# EAGLE design TQFP32Adapter (EAGLE 6.4)
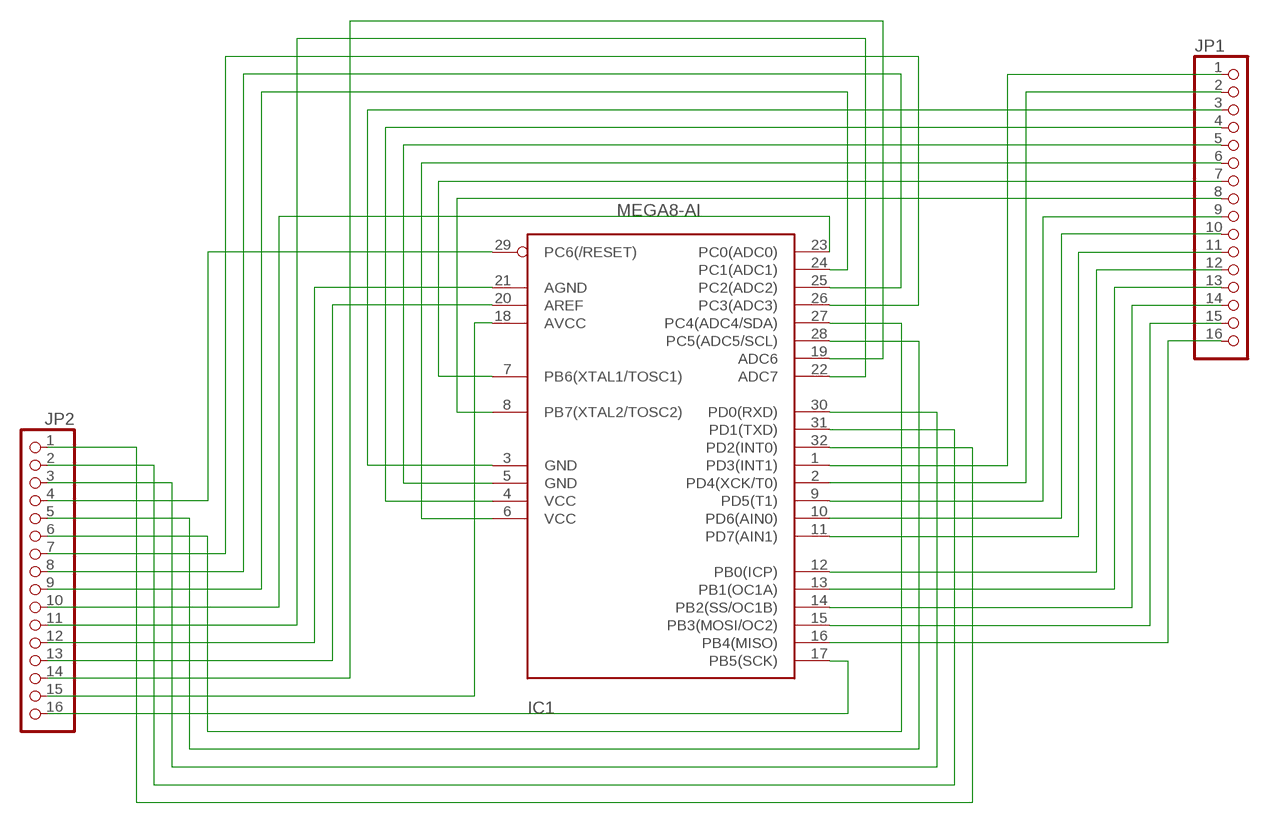
[diagram p0: schematic, sheet 1]

## Parts
IC1  MEGA8-AI  [TQFP32-08]
JP1  PINHD-1X16  [1X16]
JP2  PINHD-1X16  [1X16]

## Nets
N$1: IC1.1(PD3(INT1)) JP1.1
N$2: IC1.2(PD4(XCK/T0)) JP1.2
N$3: IC1.3(GND) JP1.3
N$4: IC1.4(VCC) JP1.4
N$5: IC1.5(GND) JP1.5
N$6: IC1.6(VCC) JP1.6
N$7: IC1.7(PB6(XTAL1/TOSC1)) JP1.7
N$8: IC1.8(PB7(XTAL2/TOSC2)) JP1.8
N$9: IC1.9(PD5(T1)) JP1.9
N$10: IC1.10(PD6(AIN0)) JP1.10
N$11: IC1.11(PD7(AIN1)) JP1.11
N$12: IC1.12(PB0(ICP)) JP1.12
N$13: IC1.13(PB1(OC1A)) JP1.13
N$14: IC1.14(PB2(SS/OC1B)) JP1.14
N$15: IC1.15(PB3(MOSI/OC2)) JP1.15
N$16: IC1.16(PB4(MISO)) JP1.16
N$17: IC1.17(PB5(SCK)) JP2.16
N$18: IC1.18(AVCC) JP2.15
N$19: IC1.19(ADC6) JP2.14
N$20: IC1.20(AREF) JP2.13
N$21: IC1.21(AGND) JP2.12
N$22: IC1.22(ADC7) JP2.11
N$23: IC1.23(PC0(ADC0)) JP2.10
N$24: IC1.24(PC1(ADC1)) JP2.9
N$25: IC1.25(PC2(ADC2)) JP2.8
N$26: IC1.26(PC3(ADC3)) JP2.7
N$27: IC1.27(PC4(ADC4/SDA)) JP2.6
N$28: IC1.28(PC5(ADC5/SCL)) JP2.5
N$29: IC1.29(PC6(/RESET)) JP2.4
N$30: IC1.30(PD0(RXD)) JP2.3
N$31: IC1.31(PD1(TXD)) JP2.2
N$32: IC1.32(PD2(INT0)) JP2.1

## Library data of the parts
IC1 = avr-6:MEGA8: MICROCONTROLLER 8 Kbytes FLASH 1 kbytes SRAM 512 bytes EEPROM USART 6-channel 10 bit ADC 2-channel 8 bit ADC
JP1 JP2 = pinhead:PINHD-1X16: PIN HEADER

## Board
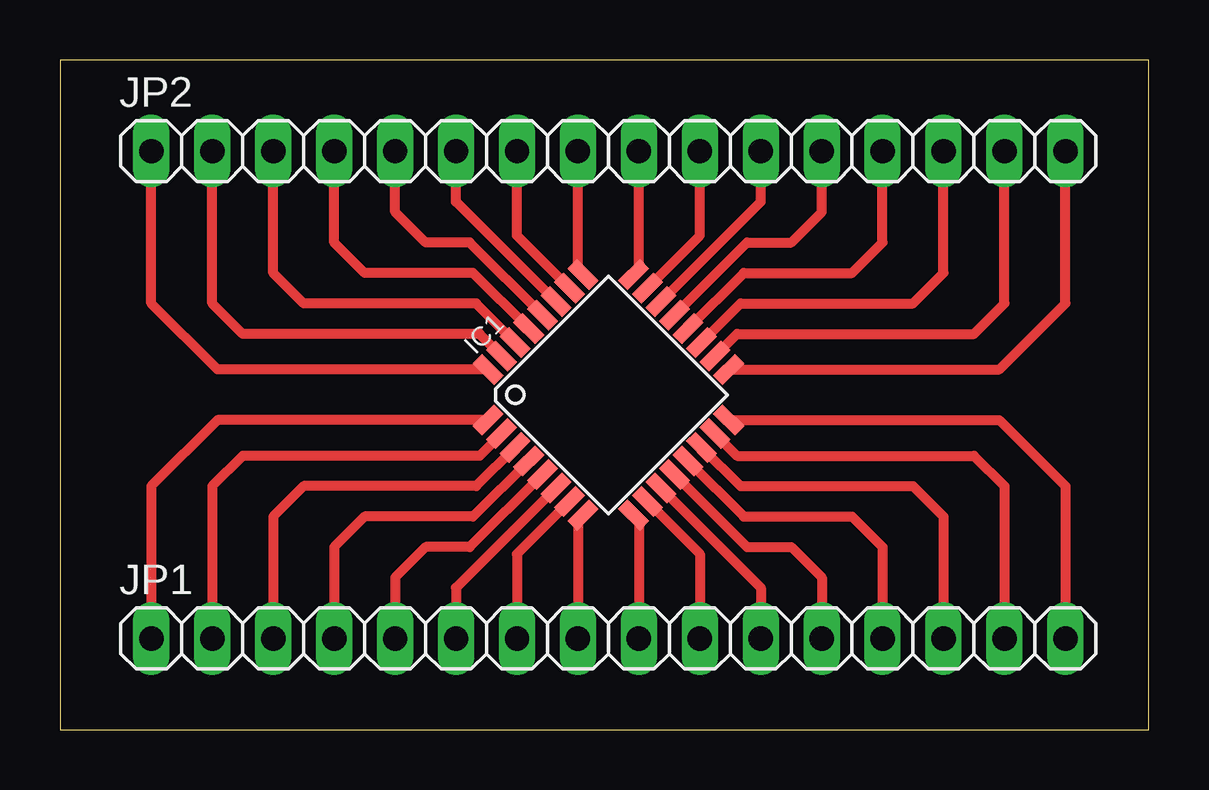
[diagram p1: board, top side]

Size 45.39 x 27.93 mm. Coordinates in mm from the lower left corner, seen from the top.
Outline: 0,0 45.39,0 45.39,27.93 0,27.93 0,0
Copper layers (1*16): Top 0.035mm / dielectric 1.5mm / Bottom 0.035mm
Design rules "default": minimum track width 10mil, minimum drill 24mil, track to track 8mil, track to pad 8mil, pad to pad 8mil, via to via 8mil, smd to smd 8mil, copper to edge 40mil, drill to drill 8mil, minimum pad ring 10mil, minimum via ring 8mil, stop-mask expansion 4mil, vias tented up to drill 0mil, thermal gap 10mil

### Footprints (pad centres in the part's own frame; a part is rotated, then mirrored left to right if it is on the bottom)
TQFP32-08 = smd 1.27 x 0.559: 1 -4.293,2.8; 2 -4.293,2; 3 -4.293,1.2; 4 -4.293,0.4; 5 -4.293,-0.4; 6 -4.293,-1.2; 7 -4.293,-2; 8 -4.293,-2.8; 17 4.293,-2.8; 18 4.293,-2; 19 4.293,-1.2; 20 4.293,-0.4; 21 4.293,0.4; 22 4.293,1.2; 23 4.293,2; 24 4.293,2.8 | smd 0.559 x 1.27: 9 -2.8,-4.293; 10 -2,-4.293; 11 -1.2,-4.293; 12 -0.4,-4.293; 13 0.4,-4.293; 14 1.2,-4.293; 15 2,-4.293; 16 2.8,-4.293; 25 2.8,4.293; 26 2,4.293; 27 1.2,4.293; 28 0.4,4.293; 29 -0.4,4.293; 30 -1.2,4.293; 31 -2,4.293; 32 -2.8,4.293
1X16 = drill 1.016 long: 1 -19.05,0; 2 -16.51,0; 3 -13.97,0; 4 -11.43,0; 5 -8.89,0; 6 -6.35,0; 7 -3.81,0; 8 -1.27,0; 9 1.27,0; 10 3.81,0; 11 6.35,0; 12 8.89,0; 13 11.43,0; 14 13.97,0; 15 16.51,0; 16 19.05,0

### Placement (x,y rotation side)
IC1  22.86,13.97 45 top
JP1  22.86,3.81 0 top
JP2  22.86,24.13 0 top

### Tracks (layer width: path | path; a pad name or v marks a point on that pad's centre or on a via)
N$1
  Top 0.406: IC1.1 6.57,12.91 3.81,10.16 JP1.1
N$2
  Top 0.406: IC1.2 17.49,11.43 7.62,11.43 6.35,10.16 JP1.2
N$3
  Top 0.406: IC1.3 17.35,10.16 10.16,10.16 8.89,8.89 JP1.3
N$4
  Top 0.406: IC1.4 17.21,8.89 12.7,8.89 11.43,7.62 JP1.4
N$5
  Top 0.406: IC1.5 17.08,7.62 15.24,7.62 13.97,6.35 JP1.5
N$6
  Top 0.406: IC1.6 16.51,5.92 JP1.6
N$7
  Top 0.406: IC1.7 19.05,7.33 JP1.7
N$8
  Top 0.406: IC1.8 21.59,8.74 JP1.8
N$9
  Top 0.406: IC1.9 24.13,8.74 JP1.9
N$10
  Top 0.406: IC1.10 26.67,7.33 JP1.10
N$11
  Top 0.406: IC1.11 29.21,5.92 JP1.11
N$12
  Top 0.406: IC1.12 28.64,7.62 30.48,7.62 31.75,6.35 JP1.12
N$13
  Top 0.406: IC1.13 28.51,8.89 33.02,8.89 34.29,7.62 JP1.13
N$14
  Top 0.406: IC1.14 28.37,10.16 35.56,10.16 36.83,8.89 JP1.14
N$15
  Top 0.406: IC1.15 28.23,11.43 38.1,11.43 39.37,10.16 JP1.15
N$16
  Top 0.406: IC1.16 39.16,12.91 41.91,10.16 JP1.16
N$17
  Top 0.406: IC1.17 39.16,15.03 41.91,17.78 JP2.16
N$18
  Top 0.406: IC1.18 28.23,16.51 38.1,16.51 39.37,17.78 JP2.15
N$19
  Top 0.406: IC1.19 28.37,17.78 35.56,17.78 36.83,19.05 JP2.14
N$20
  Top 0.406: IC1.20 28.51,19.05 33.02,19.05 34.29,20.32 JP2.13
N$21
  Top 0.406: IC1.21 28.64,20.32 30.48,20.32 31.75,21.59 JP2.12
N$22
  Top 0.406: IC1.22 29.21,22.02 JP2.11
N$23
  Top 0.406: IC1.23 26.67,20.61 JP2.10
N$24
  Top 0.406: IC1.24 24.13,19.2 JP2.9
N$25
  Top 0.406: IC1.25 21.59,19.2 JP2.8
N$26
  Top 0.406: IC1.26 19.05,20.61 JP2.7
N$27
  Top 0.406: IC1.27 16.51,22.02 JP2.6
N$28
  Top 0.406: IC1.28 17.08,20.32 15.24,20.32 13.97,21.59 JP2.5
N$29
  Top 0.406: IC1.29 17.21,19.05 12.7,19.05 11.43,20.32 JP2.4
N$30
  Top 0.406: IC1.30 17.35,17.78 10.16,17.78 8.89,19.05 JP2.3
N$31
  Top 0.406: IC1.31 17.49,16.51 7.62,16.51 6.35,17.78 JP2.2
N$32
  Top 0.406: IC1.32 6.57,15.03 3.81,17.78 JP2.1